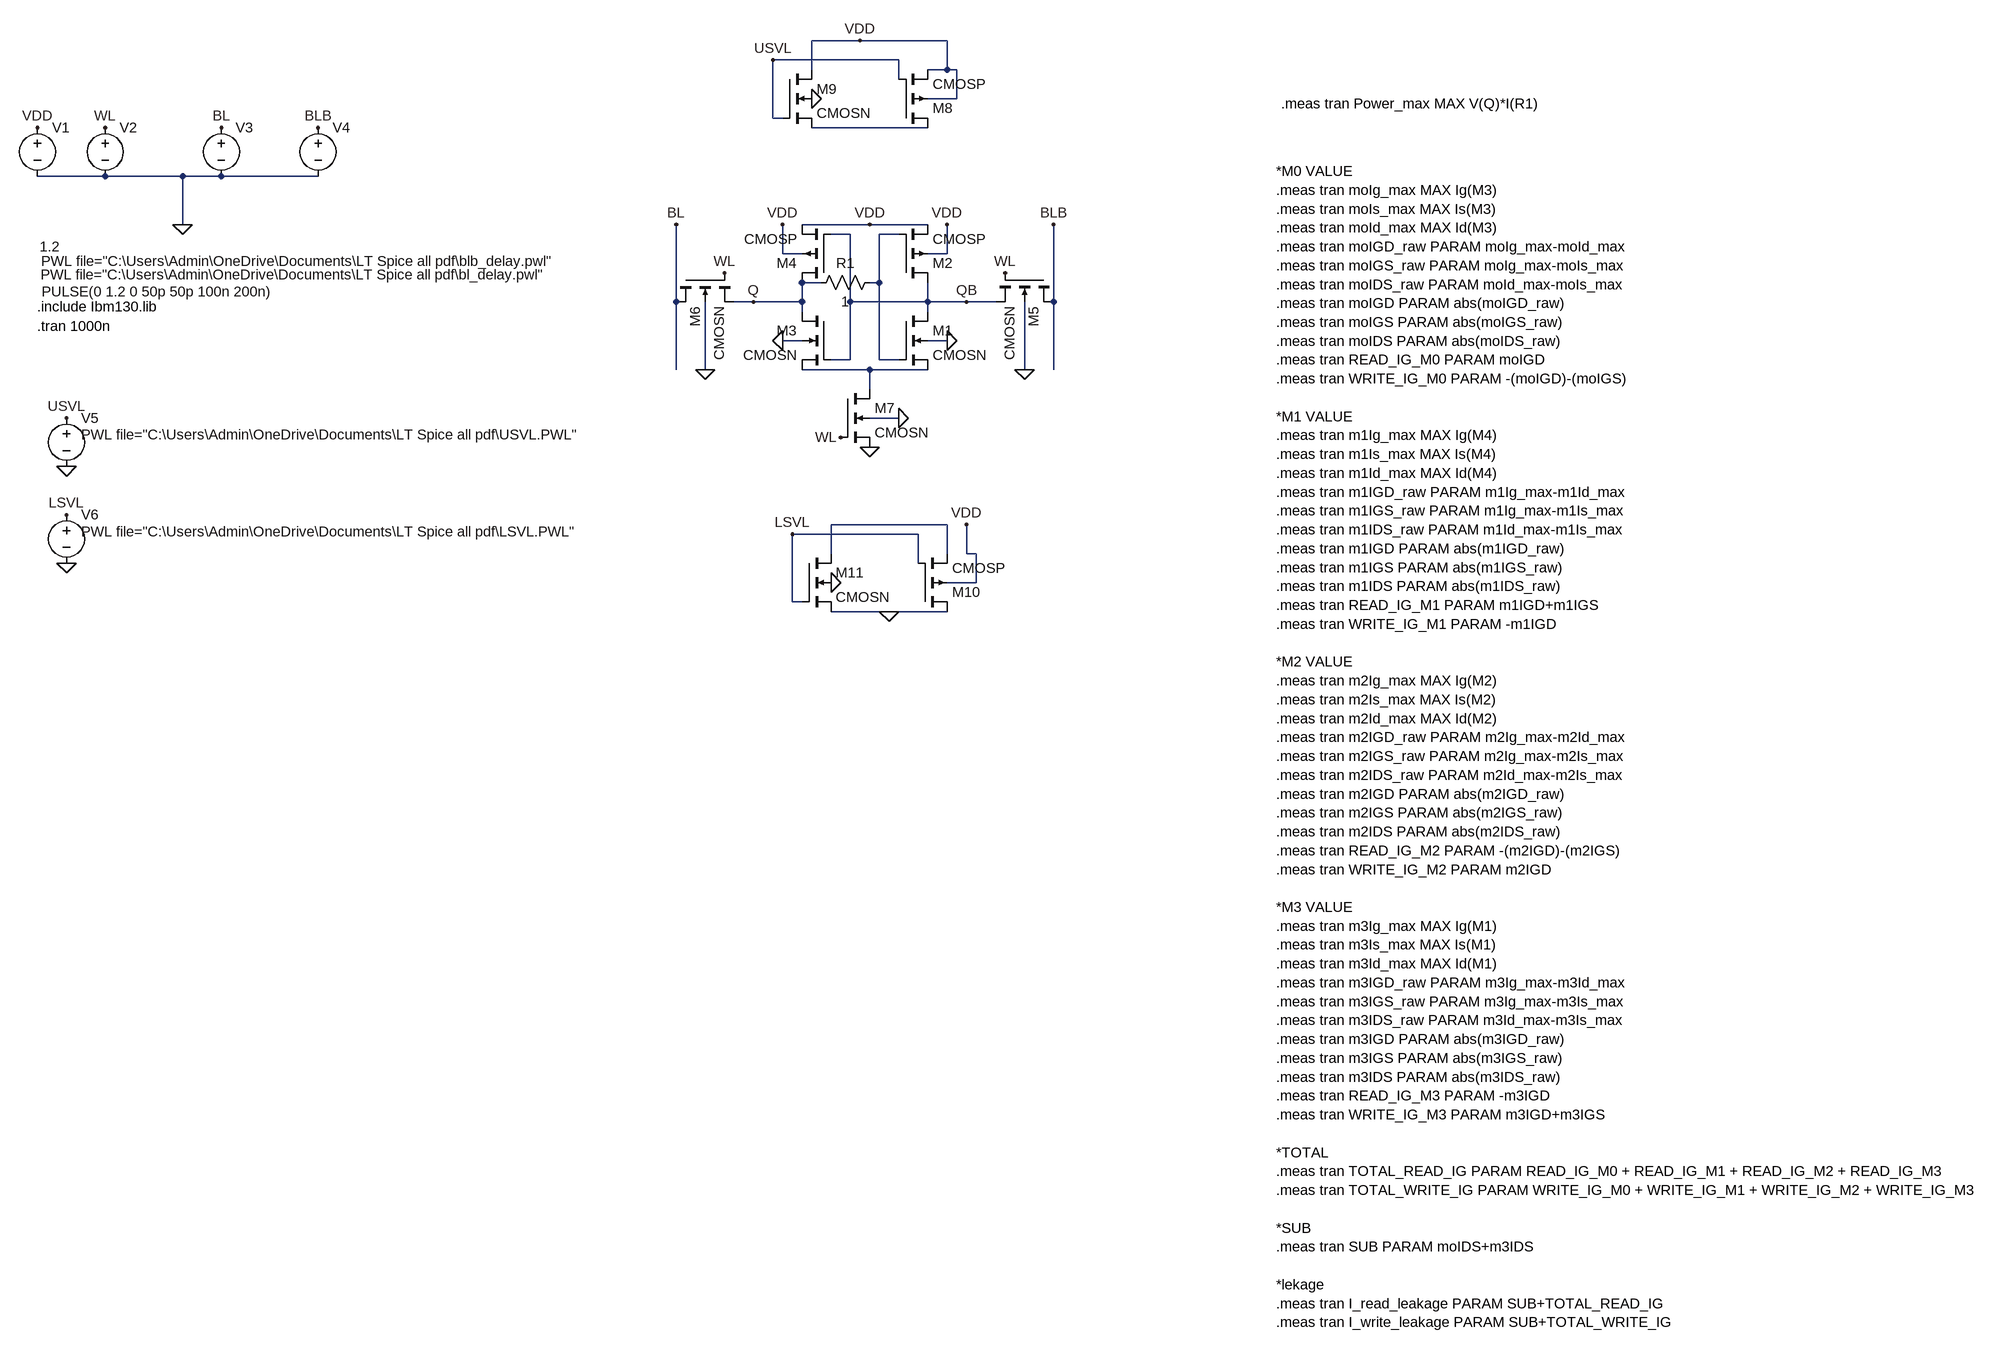
[diagram p0: schematic 7t_cmos_130nm without.asc]
7t_cmos_130nm without.asc, the LTspice schematic file:
Version 4
SHEET 1 2040 1364
WIRE 128 -576 48 -576
WIRE 272 -576 128 -576
WIRE 192 -544 -16 -544
WIRE 48 -528 48 -576
WIRE 272 -528 272 -576
WIRE 272 -528 240 -528
WIRE 288 -528 272 -528
WIRE 192 -512 192 -544
WIRE 288 -480 288 -528
WIRE 288 -480 240 -480
WIRE -16 -448 -16 -544
WIRE 0 -448 -16 -448
WIRE 240 -432 48 -432
WIRE -1120 -352 -1232 -352
WIRE -992 -352 -1120 -352
WIRE -928 -352 -992 -352
WIRE -768 -352 -928 -352
WIRE -992 -272 -992 -352
WIRE 144 -272 32 -272
WIRE 240 -272 144 -272
WIRE 112 -256 80 -256
WIRE 192 -256 160 -256
WIRE 0 -224 0 -272
WIRE 32 -224 0 -224
WIRE 272 -224 272 -272
WIRE 272 -224 240 -224
WIRE 64 -176 32 -176
WIRE 160 -176 160 -256
WIRE 160 -176 144 -176
WIRE -176 -144 -176 -272
WIRE -48 -144 -80 -144
WIRE 32 -144 32 -176
WIRE 32 -144 -48 -144
WIRE 112 -144 112 -256
WIRE 240 -144 240 -176
WIRE 240 -144 112 -144
WIRE 304 -144 240 -144
WIRE 352 -144 304 -144
WIRE 448 -144 448 -272
WIRE 32 -128 32 -144
WIRE 240 -128 240 -144
WIRE 32 -80 0 -80
WIRE 272 -80 240 -80
WIRE 112 -48 112 -144
WIRE 112 -48 80 -48
WIRE 160 -48 160 -176
WIRE 192 -48 160 -48
WIRE -176 -32 -176 -144
WIRE -128 -32 -128 -144
WIRE 144 -32 32 -32
WIRE 240 -32 144 -32
WIRE 400 -32 400 -144
WIRE 448 -32 448 -144
WIRE 144 0 144 -32
WIRE 192 48 144 48
WIRE 272 224 80 224
WIRE 224 240 16 240
WIRE 80 272 80 224
WIRE 272 272 272 224
WIRE 304 272 304 224
WIRE 320 272 304 272
WIRE 224 288 224 240
WIRE 320 320 320 272
WIRE 320 320 272 320
WIRE 16 352 16 240
WIRE 32 352 16 352
WIRE 176 368 80 368
WIRE 272 368 176 368
FLAG -96 -192 WL
FLAG 368 -192 WL
FLAG -176 -272 BL
FLAG 448 -272 BLB
FLAG -992 -272 0
FLAG -1232 -432 VDD
FLAG -1120 -432 WL
FLAG -928 -432 BL
FLAG -768 -432 BLB
FLAG -48 -144 Q
FLAG 304 -144 QB
FLAG 128 -576 VDD
FLAG 48 -480 0
FLAG -16 -544 USVL
FLAG -1184 128 0
FLAG -1184 48 USVL
FLAG 80 320 0
FLAG 176 368 0
FLAG 304 224 VDD
FLAG 16 240 LSVL
FLAG 272 -80 0
FLAG 0 -80 0
FLAG -128 -32 0
FLAG 400 -32 0
FLAG 0 -272 VDD
FLAG 272 -272 VDD
FLAG 96 80 WL
FLAG -1184 288 0
FLAG -1184 208 LSVL
FLAG 192 48 0
FLAG 144 96 0
FLAG 144 -272 VDD
SYMBOL CMOSN 192 -128 R0
SYMATTR InstName M1
SYMATTR Value2 l=130nm w=360nm
SYMBOL CMOSP 192 -176 M180
SYMATTR InstName M2
SYMATTR Value2 l=130nm w=260nm
SYMBOL CMOSN 80 -128 M0
SYMATTR InstName M3
SYMATTR Value2 l=130nm w=360nm
SYMBOL CMOSP 80 -176 R180
SYMATTR InstName M4
SYMATTR Value2 l=130nm w=260nm
SYMBOL CMOSN 448 -192 R90
SYMATTR InstName M5
SYMATTR Value2 l=130nm w=260nm
SYMBOL CMOSN -176 -192 M90
SYMATTR InstName M6
SYMATTR Value2 l=130nm w=260nm
SYMBOL voltage -1232 -448 R0
WINDOW 3 4 213 Left 2
WINDOW 123 0 0 Left 0
WINDOW 39 0 0 Left 0
SYMATTR Value 1.2
SYMATTR InstName V1
SYMBOL voltage -1120 -448 R0
WINDOW 3 -105 287 Left 2
WINDOW 123 0 0 Left 0
WINDOW 39 0 0 Left 0
SYMATTR Value PULSE(0 1.2 0 50p 50p 100n 200n)
SYMATTR InstName V2
SYMBOL voltage -928 -448 R0
WINDOW 3 -299 259 Left 2
WINDOW 123 0 0 Left 0
WINDOW 39 0 0 Left 0
SYMATTR Value PWL file="C:\Users\Admin\OneDrive\Documents\LT Spice all pdf\bl_delay.pwl"
SYMATTR InstName V3
SYMBOL voltage -768 -448 R0
WINDOW 3 -458 237 Left 2
WINDOW 123 0 0 Left 0
WINDOW 39 0 0 Left 0
SYMATTR Value PWL file="C:\Users\Admin\OneDrive\Documents\LT Spice all pdf\blb_delay.pwl"
SYMATTR InstName V4
SYMBOL CMOSN 96 0 R0
SYMATTR InstName M7
SYMATTR Value2 l=130nm w=260nm
SYMBOL res 160 -192 R90
WINDOW 0 0 56 VBottom 2
WINDOW 3 32 56 VTop 2
SYMATTR InstName R1
SYMATTR Value 1
SYMBOL CMOSP 192 -432 M180
SYMATTR InstName M8
SYMATTR Value2 l=130nm w=140nm
SYMBOL CMOSN 0 -528 R0
SYMATTR InstName M9
SYMATTR Value2 l=130nm w=20nm
SYMBOL voltage -1184 32 R0
WINDOW 3 24 44 Left 2
WINDOW 123 0 0 Left 0
WINDOW 39 0 0 Left 0
SYMATTR Value PWL file="C:\Users\Admin\OneDrive\Documents\LT Spice all pdf\USVL.PWL"
SYMATTR InstName V5
SYMBOL CMOSP 224 368 M180
SYMATTR InstName M10
SYMATTR Value2 l=130nm w=140nm
SYMBOL CMOSN 32 272 R0
SYMATTR InstName M11
SYMATTR Value2 l=130nm w=20nm
SYMBOL voltage -1184 192 R0
WINDOW 3 24 44 Left 2
WINDOW 123 0 0 Left 0
WINDOW 39 0 0 Left 0
SYMATTR Value PWL file="C:\Users\Admin\OneDrive\Documents\LT Spice all pdf\LSVL.PWL"
SYMATTR InstName V6
TEXT -1232 -136 Left 2 !.include Ibm130.lib
TEXT -1232 -104 Left 2 !.tran 1000n
TEXT 816 -360 Left 2 !*M0 VALUE\n.meas tran moIg_max MAX Ig(M3)\n.meas tran moIs_max MAX Is(M3)\n.meas tran moId_max MAX Id(M3)\n.meas tran moIGD_raw PARAM moIg_max-moId_max\n.meas tran moIGS_raw PARAM moIg_max-moIs_max\n.meas tran moIDS_raw PARAM moId_max-moIs_max\n.meas tran moIGD PARAM abs(moIGD_raw)\n.meas tran moIGS PARAM abs(moIGS_raw)\n.meas tran moIDS PARAM abs(moIDS_raw)\n.meas tran READ_IG_M0 PARAM moIGD\n.meas tran WRITE_IG_M0 PARAM -(moIGD)-(moIGS)\n \n*M1 VALUE\n.meas tran m1Ig_max MAX Ig(M4)\n.meas tran m1Is_max MAX Is(M4)\n.meas tran m1Id_max MAX Id(M4)\n.meas tran m1IGD_raw PARAM m1Ig_max-m1Id_max\n.meas tran m1IGS_raw PARAM m1Ig_max-m1Is_max\n.meas tran m1IDS_raw PARAM m1Id_max-m1Is_max\n.meas tran m1IGD PARAM abs(m1IGD_raw)\n.meas tran m1IGS PARAM abs(m1IGS_raw)\n.meas tran m1IDS PARAM abs(m1IDS_raw)\n.meas tran READ_IG_M1 PARAM m1IGD+m1IGS\n.meas tran WRITE_IG_M1 PARAM -m1IGD\n \n*M2 VALUE\n.meas tran m2Ig_max MAX Ig(M2)\n.meas tran m2Is_max MAX Is(M2)\n.meas tran m2Id_max MAX Id(M2)\n.meas tran m2IGD_raw PARAM m2Ig_max-m2Id_max\n.meas tran m2IGS_raw PARAM m2Ig_max-m2Is_max\n.meas tran m2IDS_raw PARAM m2Id_max-m2Is_max\n.meas tran m2IGD PARAM abs(m2IGD_raw)\n.meas tran m2IGS PARAM abs(m2IGS_raw)\n.meas tran m2IDS PARAM abs(m2IDS_raw)\n.meas tran READ_IG_M2 PARAM -(m2IGD)-(m2IGS)\n.meas tran WRITE_IG_M2 PARAM m2IGD\n \n*M3 VALUE\n.meas tran m3Ig_max MAX Ig(M1)\n.meas tran m3Is_max MAX Is(M1)\n.meas tran m3Id_max MAX Id(M1)\n.meas tran m3IGD_raw PARAM m3Ig_max-m3Id_max\n.meas tran m3IGS_raw PARAM m3Ig_max-m3Is_max\n.meas tran m3IDS_raw PARAM m3Id_max-m3Is_max\n.meas tran m3IGD PARAM abs(m3IGD_raw)\n.meas tran m3IGS PARAM abs(m3IGS_raw)\n.meas tran m3IDS PARAM abs(m3IDS_raw)\n.meas tran READ_IG_M3 PARAM -m3IGD\n.meas tran WRITE_IG_M3 PARAM m3IGD+m3IGS\n \n*TOTAL \n.meas tran TOTAL_READ_IG PARAM READ_IG_M0 + READ_IG_M1 + READ_IG_M2 + READ_IG_M3\n.meas tran TOTAL_WRITE_IG PARAM WRITE_IG_M0 + WRITE_IG_M1 + WRITE_IG_M2 + WRITE_IG_M3\n \n*SUB\n.meas tran SUB PARAM moIDS+m3IDS\n \n*lekage\n.meas tran I_read_leakage PARAM SUB+TOTAL_READ_IG\n.meas tran I_write_leakage PARAM SUB+TOTAL_WRITE_IG
TEXT 824 -472 Left 2 !.meas tran Power_max MAX V(Q)*I(R1)

The netlist it stands for:
* 7t_cmos_130nm without.asc
M1 QB N002 N003 0 CMOSN l=130nm w=360nm
M2 QB N002 VDD VDD CMOSP l=130nm w=260nm
M3 Q QB N003 0 CMOSN l=130nm w=360nm
M4 Q QB VDD VDD CMOSP l=130nm w=260nm
M5 BLB WL QB 0 CMOSN l=130nm w=260nm
M6 BL WL Q 0 CMOSN l=130nm w=260nm
V1 VDD 0 1.2
V2 WL 0 PULSE(0 1.2 0 50p 50p 100n 200n)
V3 BL 0 PWL file="C:\Users\Admin\OneDrive\Documents\LT Spice all pdf\bl_delay.pwl"
V4 BLB 0 PWL file="C:\Users\Admin\OneDrive\Documents\LT Spice all pdf\blb_delay.pwl"
M7 N003 WL 0 0 CMOSN l=130nm w=260nm
R1 N002 Q 1
M8 N001 USVL VDD VDD CMOSP l=130nm w=140nm
M9 VDD USVL N001 0 CMOSN l=130nm w=20nm
V5 USVL 0 PWL file="C:\Users\Admin\OneDrive\Documents\LT Spice all pdf\USVL.PWL"
M10 0 LSVL N004 VDD CMOSP l=130nm w=140nm
M11 N004 LSVL 0 0 CMOSN l=130nm w=20nm
V6 LSVL 0 PWL file="C:\Users\Admin\OneDrive\Documents\LT Spice all pdf\LSVL.PWL"
.model NMOS NMOS
.model PMOS PMOS
.lib standard.mos
.include Ibm130.lib
.tran 1000n
*M0 VALUE
.meas tran moIg_max MAX Ig(M3)
.meas tran moIs_max MAX Is(M3)
.meas tran moId_max MAX Id(M3)
.meas tran moIGD_raw PARAM moIg_max-moId_max
.meas tran moIGS_raw PARAM moIg_max-moIs_max
.meas tran moIDS_raw PARAM moId_max-moIs_max
.meas tran moIGD PARAM abs(moIGD_raw)
.meas tran moIGS PARAM abs(moIGS_raw)
.meas tran moIDS PARAM abs(moIDS_raw)
.meas tran READ_IG_M0 PARAM moIGD
.meas tran WRITE_IG_M0 PARAM -(moIGD)-(moIGS)
*M1 VALUE
.meas tran m1Ig_max MAX Ig(M4)
.meas tran m1Is_max MAX Is(M4)
.meas tran m1Id_max MAX Id(M4)
.meas tran m1IGD_raw PARAM m1Ig_max-m1Id_max
.meas tran m1IGS_raw PARAM m1Ig_max-m1Is_max
.meas tran m1IDS_raw PARAM m1Id_max-m1Is_max
.meas tran m1IGD PARAM abs(m1IGD_raw)
.meas tran m1IGS PARAM abs(m1IGS_raw)
.meas tran m1IDS PARAM abs(m1IDS_raw)
.meas tran READ_IG_M1 PARAM m1IGD+m1IGS
.meas tran WRITE_IG_M1 PARAM -m1IGD
*M2 VALUE
.meas tran m2Ig_max MAX Ig(M2)
.meas tran m2Is_max MAX Is(M2)
.meas tran m2Id_max MAX Id(M2)
.meas tran m2IGD_raw PARAM m2Ig_max-m2Id_max
.meas tran m2IGS_raw PARAM m2Ig_max-m2Is_max
.meas tran m2IDS_raw PARAM m2Id_max-m2Is_max
.meas tran m2IGD PARAM abs(m2IGD_raw)
.meas tran m2IGS PARAM abs(m2IGS_raw)
.meas tran m2IDS PARAM abs(m2IDS_raw)
.meas tran READ_IG_M2 PARAM -(m2IGD)-(m2IGS)
.meas tran WRITE_IG_M2 PARAM m2IGD
*M3 VALUE
.meas tran m3Ig_max MAX Ig(M1)
.meas tran m3Is_max MAX Is(M1)
.meas tran m3Id_max MAX Id(M1)
.meas tran m3IGD_raw PARAM m3Ig_max-m3Id_max
.meas tran m3IGS_raw PARAM m3Ig_max-m3Is_max
.meas tran m3IDS_raw PARAM m3Id_max-m3Is_max
.meas tran m3IGD PARAM abs(m3IGD_raw)
.meas tran m3IGS PARAM abs(m3IGS_raw)
.meas tran m3IDS PARAM abs(m3IDS_raw)
.meas tran READ_IG_M3 PARAM -m3IGD
.meas tran WRITE_IG_M3 PARAM m3IGD+m3IGS
*TOTAL
.meas tran TOTAL_READ_IG PARAM READ_IG_M0 + READ_IG_M1 + READ_IG_M2 + READ_IG_M3
.meas tran TOTAL_WRITE_IG PARAM WRITE_IG_M0 + WRITE_IG_M1 + WRITE_IG_M2 + WRITE_IG_M3
*SUB
.meas tran SUB PARAM moIDS+m3IDS
*lekage
.meas tran I_read_leakage PARAM SUB+TOTAL_READ_IG
.meas tran I_write_leakage PARAM SUB+TOTAL_WRITE_IG
.meas tran Power_max MAX V(Q)*I(R1)
.backanno
.end